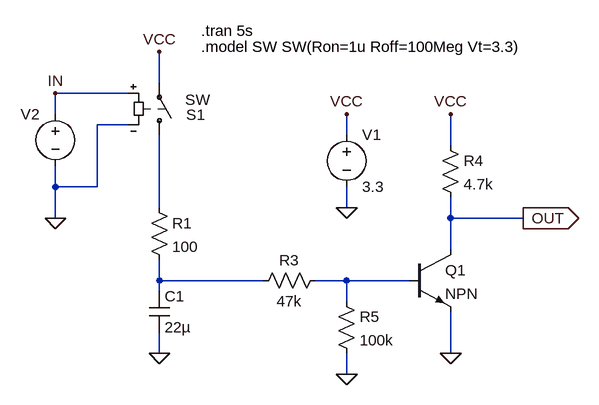
[diagram p0: schematic v2.0.asc]
v2.0.asc, the LTspice schematic file:
Version 4.1
SHEET 1 1772 996
WIRE 304 240 304 192
WIRE 256 256 144 256
WIRE 144 288 144 256
WIRE 256 304 208 304
WIRE 592 320 592 288
WIRE 752 336 752 288
WIRE 144 400 144 368
WIRE 208 400 208 304
WIRE 208 400 144 400
WIRE 304 432 304 320
WIRE 592 432 592 400
WIRE 144 448 144 400
WIRE 752 448 752 416
WIRE 864 448 752 448
WIRE 752 496 752 448
WIRE 304 544 304 512
WIRE 464 544 304 544
WIRE 592 544 544 544
WIRE 688 544 592 544
WIRE 304 560 304 544
WIRE 592 576 592 544
WIRE 304 656 304 624
WIRE 752 656 752 592
WIRE 592 688 592 656
FLAG 592 432 0
FLAG 864 448 OUT
IOPIN 864 448 Out
FLAG 144 256 IN
FLAG 304 656 0
FLAG 144 448 0
FLAG 592 288 VCC
FLAG 304 192 VCC
FLAG 752 656 0
FLAG 752 288 VCC
FLAG 592 688 0
SYMBOL sw 304 336 M180
WINDOW 0 41 47 Left 2
WINDOW 3 40 70 Left 2
SYMATTR InstName S1
SYMBOL res 288 416 R0
SYMATTR InstName R1
SYMATTR Value 100
SYMBOL voltage 592 304 R0
WINDOW 123 0 0 Left 0
WINDOW 39 0 0 Left 0
SYMATTR InstName V1
SYMATTR Value 3.3
SYMBOL voltage 144 272 M0
WINDOW 3 41 64 Invisible 2
WINDOW 123 0 0 Left 0
WINDOW 39 39 69 Left 2
SYMATTR Value PULSE(0 5 0.5 1n 1n 50m 80m 1)
SYMATTR InstName V2
SYMBOL cap 288 560 R0
SYMATTR InstName C1
SYMATTR Value 22µ
SYMATTR SpiceLine Rser=0.05
SYMBOL res 560 528 R90
WINDOW 0 0 56 VBottom 2
WINDOW 3 32 56 VTop 2
SYMATTR InstName R3
SYMATTR Value 47k
SYMBOL npn 688 496 R0
SYMATTR InstName Q1
SYMBOL res 736 320 R0
SYMATTR InstName R4
SYMATTR Value 4.7k
SYMBOL res 576 560 R0
SYMATTR InstName R5
SYMATTR Value 100k
TEXT 368 160 Left 2 !.tran 5s
TEXT 368 184 Left 2 !.model SW SW(Ron=1u Roff=100Meg Vt=3.3)

The netlist it stands for:
* v2.0.asc
S1 N001 VCC IN 0 SW
R1 N001 N002 100
V1 VCC 0 3.3
V2 IN 0 PULSE(0 5 0.5 1n 1n 50m 80m 1)
C1 N002 0 22µ Rser=0.05
R3 N003 N002 47k
Q1 OUT N003 0 0 NPN
R4 VCC OUT 4.7k
R5 N003 0 100k
.model NPN NPN
.model PNP PNP
.lib standard.bjt
.tran 5s
.model SW SW(Ron=1u Roff=100Meg Vt=3.3)
.backanno
.end